# EAGLE design GROUP6_GPIO_Hat_v4.0_assignment (EAGLE 9.6.2)
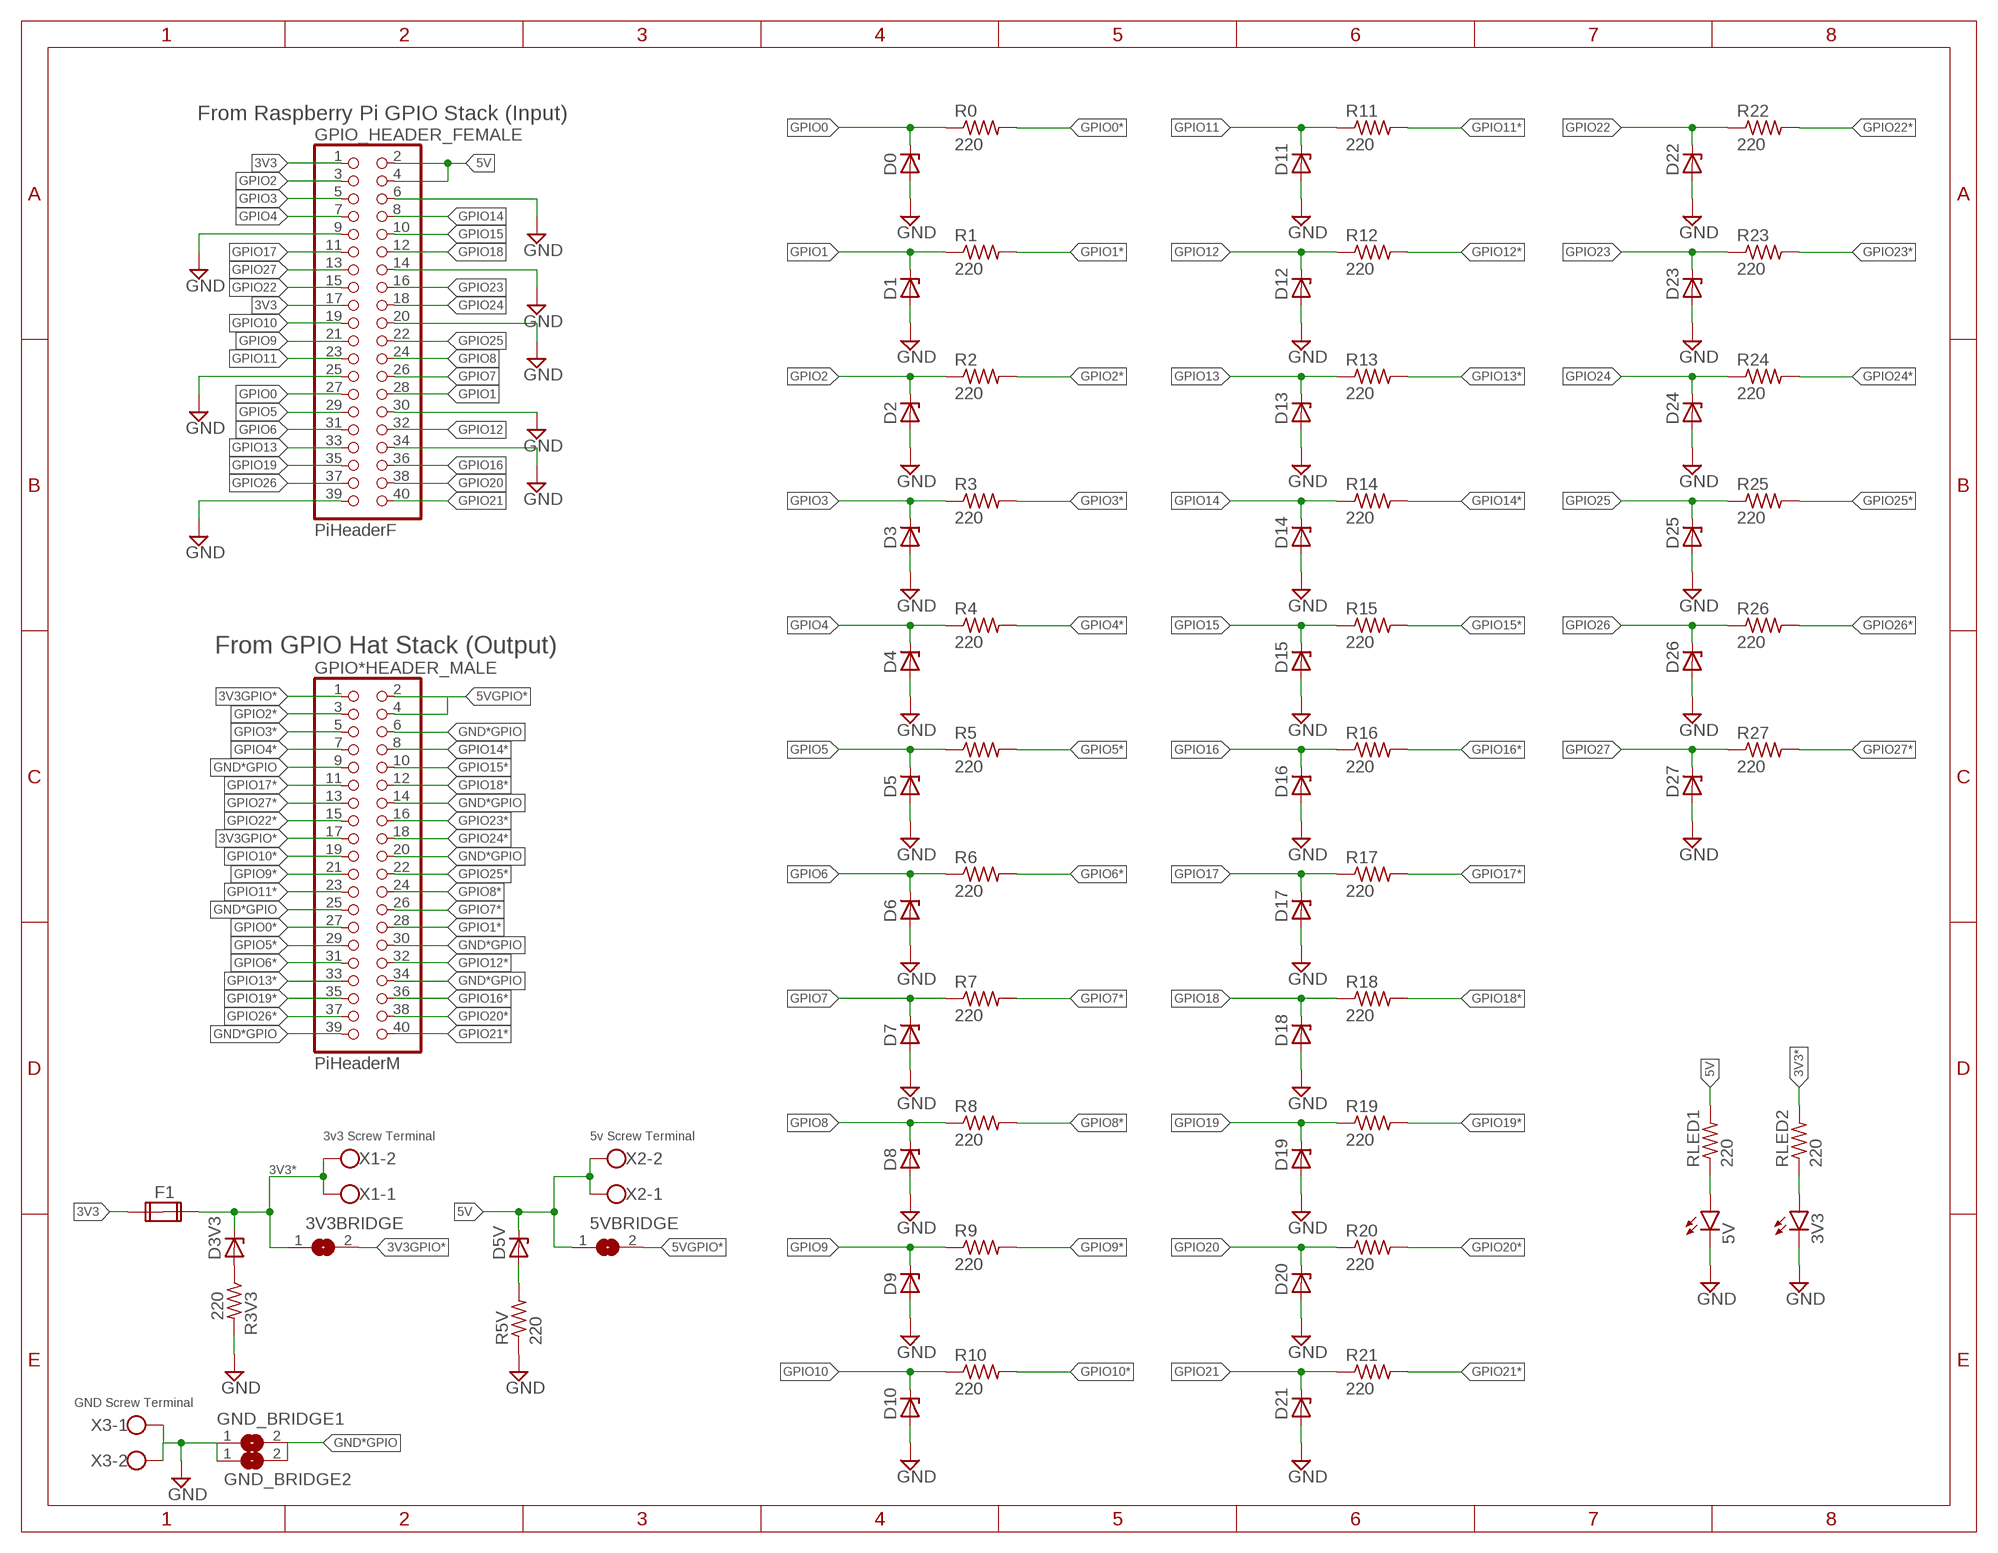
[diagram p0: schematic, sheet 1]

## Parts
3V3  LED5MM  [LED5MM]
3V3BRIDGE  SJ  [SJ]
5V  LED5MM  [LED5MM]
5VBRIDGE  SJ  [SJ]
D0  1N4728  [DO41Z10]
D1  1N4728  [DO41Z10]
D2  1N4728  [DO41Z10]
D3  1N4728  [DO41Z10]
D3V3  1N4728  [DO41Z10]
D4  1N4728  [DO41Z10]
D5  1N4728  [DO41Z10]
D5V  1N4728  [DO41Z10]
D6  1N4728  [DO41Z10]
D7  1N4728  [DO41Z10]
D8  1N4728  [DO41Z10]
D9  1N4728  [DO41Z10]
D10  1N4728  [DO41Z10]
D11  1N4728  [DO41Z10]
D12  1N4728  [DO41Z10]
D13  1N4728  [DO41Z10]
D14  1N4728  [DO41Z10]
D15  1N4728  [DO41Z10]
D16  1N4728  [DO41Z10]
D17  1N4728  [DO41Z10]
D18  1N4728  [DO41Z10]
D19  1N4728  [DO41Z10]
D20  1N4728  [DO41Z10]
D21  1N4728  [DO41Z10]
D22  1N4728  [DO41Z10]
D23  1N4728  [DO41Z10]
D24  1N4728  [DO41Z10]
D25  1N4728  [DO41Z10]
D26  1N4728  [DO41Z10]
D27  1N4728  [DO41Z10]
F1  FUSE2P  [FUSE1]
GND_BRIDGE1  SJ  [SJ]
GND_BRIDGE2  SJ  [SJ]
GPIO*HEADER_MALE  PiHeaderM  PINHD-2X20  [2X20]
GPIO_HEADER_FEMALE  PiHeaderF  PINHD-2X20  [2X20]
R0  220  R-US_0207/10  [0207/10]
R1  220  R-US_0207/10  [0207/10]
R2  220  R-US_0207/10  [0207/10]
R3  220  R-US_0207/10  [0207/10]
R3V3  220  R-US_0207/10  [0207/10]
R4  220  R-US_0207/10  [0207/10]
R5  220  R-US_0207/10  [0207/10]
R5V  220  R-US_0207/10  [0207/10]
R6  220  R-US_0207/10  [0207/10]
R7  220  R-US_0207/10  [0207/10]
R8  220  R-US_0207/10  [0207/10]
R9  220  R-US_0207/10  [0207/10]
R10  220  R-US_0207/10  [0207/10]
R11  220  R-US_0207/10  [0207/10]
R12  220  R-US_0207/10  [0207/10]
R13  220  R-US_0207/10  [0207/10]
R14  220  R-US_0207/10  [0207/10]
R15  220  R-US_0207/10  [0207/10]
R16  220  R-US_0207/10  [0207/10]
R17  220  R-US_0207/10  [0207/10]
R18  220  R-US_0207/10  [0207/10]
R19  220  R-US_0207/10  [0207/10]
R20  220  R-US_0207/10  [0207/10]
R21  220  R-US_0207/10  [0207/10]
R22  220  R-US_0207/10  [0207/10]
R23  220  R-US_0207/10  [0207/10]
R24  220  R-US_0207/10  [0207/10]
R25  220  R-US_0207/10  [0207/10]
R26  220  R-US_0207/10  [0207/10]
R27  220  R-US_0207/10  [0207/10]
RLED1  220  R-US_0207/10  [0207/10]
RLED2  220  R-US_0207/10  [0207/10]
X1  W237-102  [W237-102]
X2  W237-102  [W237-102]
X3  W237-102  [W237-102]

## Nets
3V3: F1.1A GPIO_HEADER_FEMALE.1 GPIO_HEADER_FEMALE.17
3V3*: 3V3BRIDGE.1 D3V3.C F1.2A RLED2.2 X1.1 X1.2
3V3GPIO*: 3V3BRIDGE.2 GPIO*HEADER_MALE.1 GPIO*HEADER_MALE.17
5V: 5VBRIDGE.1 D5V.C GPIO_HEADER_FEMALE.2 GPIO_HEADER_FEMALE.4 RLED1.2 X2.1 X2.2
5VGPIO*: 5VBRIDGE.2 GPIO*HEADER_MALE.2 GPIO*HEADER_MALE.4
GND: 3V3.K(C) 5V.K(C) D0.A D1.A D2.A D3.A D4.A D5.A D6.A D7.A D8.A D9.A D10.A D11.A D12.A D13.A D14.A D15.A D16.A D17.A D18.A D19.A D20.A D21.A D22.A D23.A D24.A D25.A D26.A D27.A GND_BRIDGE1.1 GND_BRIDGE2.1 GPIO_HEADER_FEMALE.6 GPIO_HEADER_FEMALE.9 GPIO_HEADER_FEMALE.14 GPIO_HEADER_FEMALE.20 GPIO_HEADER_FEMALE.25 GPIO_HEADER_FEMALE.30 GPIO_HEADER_FEMALE.34 GPIO_HEADER_FEMALE.39 R3V3.2 R5V.1 X3.1 X3.2
GND*GPIO: GND_BRIDGE1.2 GND_BRIDGE2.2 GPIO*HEADER_MALE.6 GPIO*HEADER_MALE.9 GPIO*HEADER_MALE.14 GPIO*HEADER_MALE.20 GPIO*HEADER_MALE.25 GPIO*HEADER_MALE.30 GPIO*HEADER_MALE.34 GPIO*HEADER_MALE.39
GPIO0: D0.C GPIO_HEADER_FEMALE.27 R0.1
GPIO0*: GPIO*HEADER_MALE.27 R0.2
GPIO1: D1.C GPIO_HEADER_FEMALE.28 R1.1
GPIO1*: GPIO*HEADER_MALE.28 R1.2
GPIO2: D2.C GPIO_HEADER_FEMALE.3 R2.1
GPIO2*: GPIO*HEADER_MALE.3 R2.2
GPIO3: D3.C GPIO_HEADER_FEMALE.5 R3.1
GPIO3*: GPIO*HEADER_MALE.5 R3.2
GPIO4: D4.C GPIO_HEADER_FEMALE.7 R4.1
GPIO4*: GPIO*HEADER_MALE.7 R4.2
GPIO5: D5.C GPIO_HEADER_FEMALE.29 R5.1
GPIO5*: GPIO*HEADER_MALE.29 R5.2
GPIO6: D6.C GPIO_HEADER_FEMALE.31 R6.1
GPIO6*: GPIO*HEADER_MALE.31 R6.2
GPIO7: D7.C GPIO_HEADER_FEMALE.26 R7.1
GPIO7*: GPIO*HEADER_MALE.26 R7.2
GPIO8: D8.C GPIO_HEADER_FEMALE.24 R8.1
GPIO8*: GPIO*HEADER_MALE.24 R8.2
GPIO9: D9.C GPIO_HEADER_FEMALE.21 R9.1
GPIO9*: GPIO*HEADER_MALE.21 R9.2
GPIO10: D10.C GPIO_HEADER_FEMALE.19 R10.1
GPIO10*: GPIO*HEADER_MALE.19 R10.2
GPIO11: D11.C GPIO_HEADER_FEMALE.23 R11.1
GPIO11*: GPIO*HEADER_MALE.23 R11.2
GPIO12: D12.C GPIO_HEADER_FEMALE.32 R12.1
GPIO12*: GPIO*HEADER_MALE.32 R12.2
GPIO13: D13.C GPIO_HEADER_FEMALE.33 R13.1
GPIO13*: GPIO*HEADER_MALE.33 R13.2
GPIO14: D14.C GPIO_HEADER_FEMALE.8 R14.1
GPIO14*: GPIO*HEADER_MALE.8 R14.2
GPIO15: D15.C GPIO_HEADER_FEMALE.10 R15.1
GPIO15*: GPIO*HEADER_MALE.10 R15.2
GPIO16: D16.C GPIO_HEADER_FEMALE.36 R16.1
GPIO16*: GPIO*HEADER_MALE.36 R16.2
GPIO17: D17.C GPIO_HEADER_FEMALE.11 R17.1
GPIO17*: GPIO*HEADER_MALE.11 R17.2
GPIO18: D18.C GPIO_HEADER_FEMALE.12 R18.1
GPIO18*: GPIO*HEADER_MALE.12 R18.2
GPIO19: D19.C GPIO_HEADER_FEMALE.35 R19.1
GPIO19*: GPIO*HEADER_MALE.35 R19.2
GPIO20: D20.C GPIO_HEADER_FEMALE.38 R20.1
GPIO20*: GPIO*HEADER_MALE.38 R20.2
GPIO21: D21.C GPIO_HEADER_FEMALE.40 R21.1
GPIO21*: GPIO*HEADER_MALE.40 R21.2
GPIO22: D22.C GPIO_HEADER_FEMALE.15 R22.1
GPIO22*: GPIO*HEADER_MALE.15 R22.2
GPIO23: D23.C GPIO_HEADER_FEMALE.16 R23.1
GPIO23*: GPIO*HEADER_MALE.16 R23.2
GPIO24: D24.C GPIO_HEADER_FEMALE.18 R24.1
GPIO24*: GPIO*HEADER_MALE.18 R24.2
GPIO25: D25.C GPIO_HEADER_FEMALE.22 R25.1
GPIO25*: GPIO*HEADER_MALE.22 R25.2
GPIO26: D26.C GPIO_HEADER_FEMALE.37 R26.1
GPIO26*: GPIO*HEADER_MALE.37 R26.2
GPIO27: D27.C GPIO_HEADER_FEMALE.13 R27.1
GPIO27*: GPIO*HEADER_MALE.13 R27.2
N$5: 5V.A RLED1.1
N$6: D3V3.A R3V3.1
N$7: D5V.A R5V.2
N$8: 3V3.A RLED2.1
Unconnected: F1.1B F1.2B

## Notes on the sheet
- From Raspberry Pi GPIO Stack (Input)
- From GPIO Hat Stack (Output)
- 3v3 Screw Terminal | 5v Screw Terminal
- GND Screw Terminal

## Library data of the parts
3V3 5V = led:LED: LED OSRAM: - CHIPLED LG R971, LG N971, LY N971, LG Q971, LY Q971, LO R971, LY R971 LH N974, LH R974 LS Q976, LO Q976, LY Q976 LO Q996 - Hyper CHIPLED LW Q18S LB Q993, LB Q99A, LB R99A - SideLED LS A670, LO A670, LY A670, LG A670, LP A670 LB A673, LV A673, LT A673, LW A673 LH A674 LY A675 LS A676, LA A676, LO A676, LY A676, LW A676 LS A679, LY A679, LG A679 - Hyper Micro SIDELED® LS Y876, LA Y876, LO Y876, LY Y876 LT Y87S - SmartLED LW L88C, LW L88S LB L89C, LB L89S, LG L890 LS L89K, LO L89K, LY L89K LS L896, LA L896, LO L896, LY L896 - TOPLED LS T670, LO T670, LY T670, LG T670, LP T670 LSG T670, LSP T670, LSY T670, LOP T670, LYG T670 LG T671, LOG T671, LSG T671 LB T673, LV T673, LT T673, LW T673 LH T674 LS T676, LA T676, LO T676, LY T676, LB T676, LH T676, LSB T676, LW T676 LB T67C, LV T67C, LT T67C, LS T67K, LO T67K, LY T67K, LW E67C LS E67B, LA E67B, LO E67B, LY E67B, LB E67C, LV E67C, LT E67C LW T67C LS T679, LY T679, LG T679 LS T770, LO T770, LY T770, LG T770, LP T770 LB T773, LV T773, LT T773, LW T773 LH T774 LS E675, LA E675, LY E675, LS T675 LS T776, LA T776, LO T776, LY T776, LB T776 LHGB T686 LT T68C, LB T68C - Hyper Mini TOPLED® LB M676 - Mini TOPLED Santana® LG M470 LS M47K, LO M47K, LY M47K Source: http://www.osram.convergy.de LUXEON: - LUMILED® LXK2-PW12-R00, LXK2-PW12-S00, LXK2-PW14-U00, LXK2-PW14-V00 LXK2-PM12-R00, LXK2-PM12-S00, LXK2-PM14-U00 LXK2-PE12-Q00, LXK2-PE12-R00, LXK2-PE12-S00, LXK2-PE14-T00, LXK2-PE14-U00 LXK2-PB12-K00, LXK2-PB12-L00, LXK2-PB12-M00, LXK2-PB14-N00, LXK2-PB14-P00, LXK2-PB14-Q00 LXK2-PR12-L00, LXK2-PR12-M00, LXK2-PR14-Q00, LXK2-PR14-R00 LXK2-PD12-Q00, LXK2-PD12-R00, LXK2-PD12-S00 LXK2-PH12-R00, LXK2-PH12-S00 LXK2-PL12-P00, LXK2-PL12-Q00, LXK2-PL12-R00 Source: www.luxeon.com KINGBRIGHT: KA-3528ASYC Source: www.kingbright.com
3V3BRIDGE 5VBRIDGE GND_BRIDGE1 GND_BRIDGE2 = jumper:SJ: SMD solder JUMPER
D0 D1-D3 D3V3 D4 D5 D5V D6-D27 = Zener_1N4728:1N4728: Z DIODE 3.3 V, 1W, 5 percent Check availability <https://pricing.snapeda.com/parts/1N4728/ON%20Semiconductor/view-part?ref=eda>; AVAILABILITY: In Stock; DESCRIPTION: Zener Diode 3.3V 1.3W ±5% Through Hole DO-204AL (DO-41); MF: ON Semiconductor; MP: 1N4728; PACKAGE: DO-41 ON Semiconductor; PRICE: None; PURCHASE-URL: https://pricing.snapeda.com/search/part/1N4728/?ref=eda
F1 = special:FUSE2P: FUSE 5 x 20 mm
GPIO*HEADER_MALE GPIO_HEADER_FEMALE = adafruit:PINHD-2X20: PIN HEADER
R0 R1-R3 R3V3 R4 R5 R5V R6-R27 RLED1 RLED2 = rcl:R-US_: RESISTOR, American symbol; SPICEPREFIX: R
X1-X3 = con-wago-500:W237-102: WAGO SCREW CLAMP; MPN: 237-102; OC_FARNELL: unknown; OC_NEWARK: 70K9898

## Board
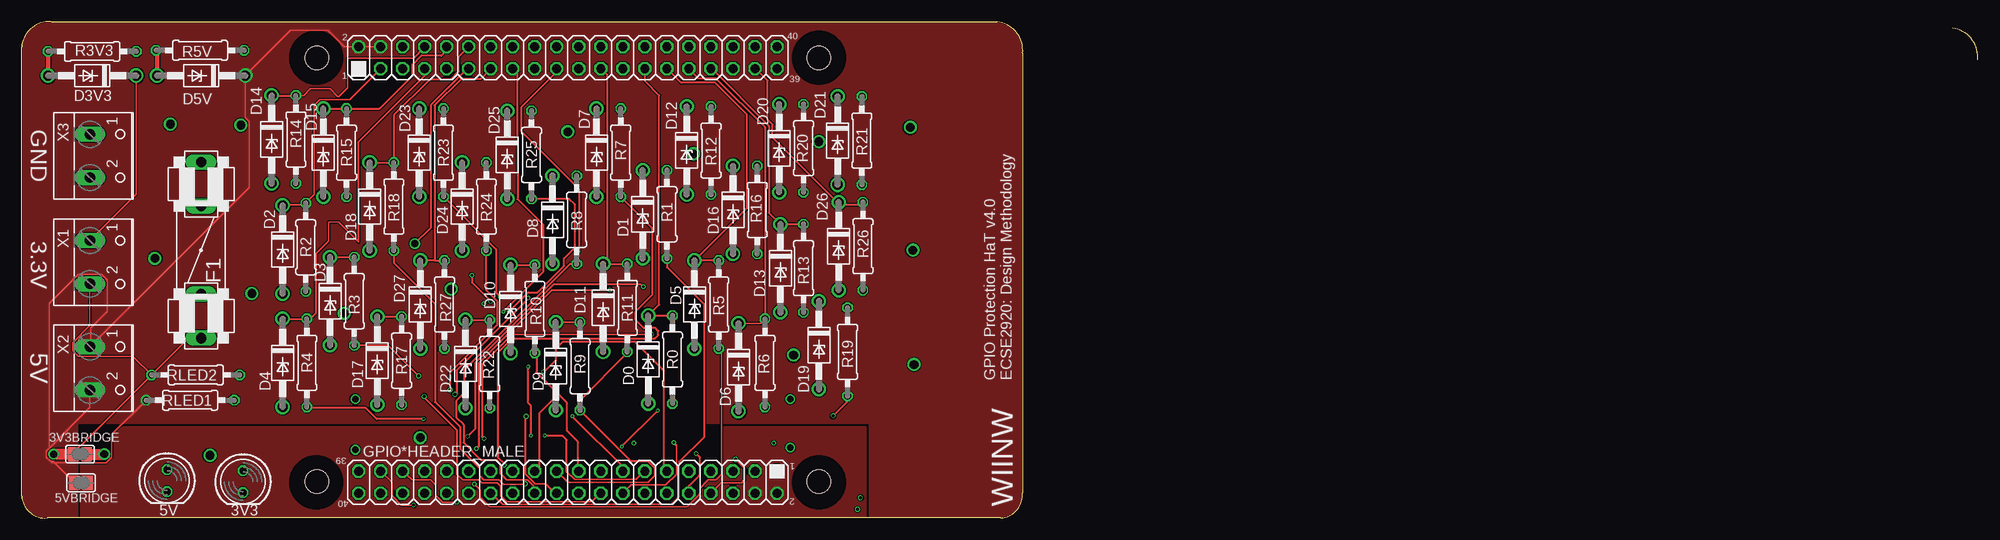
[diagram p1: board, top side]
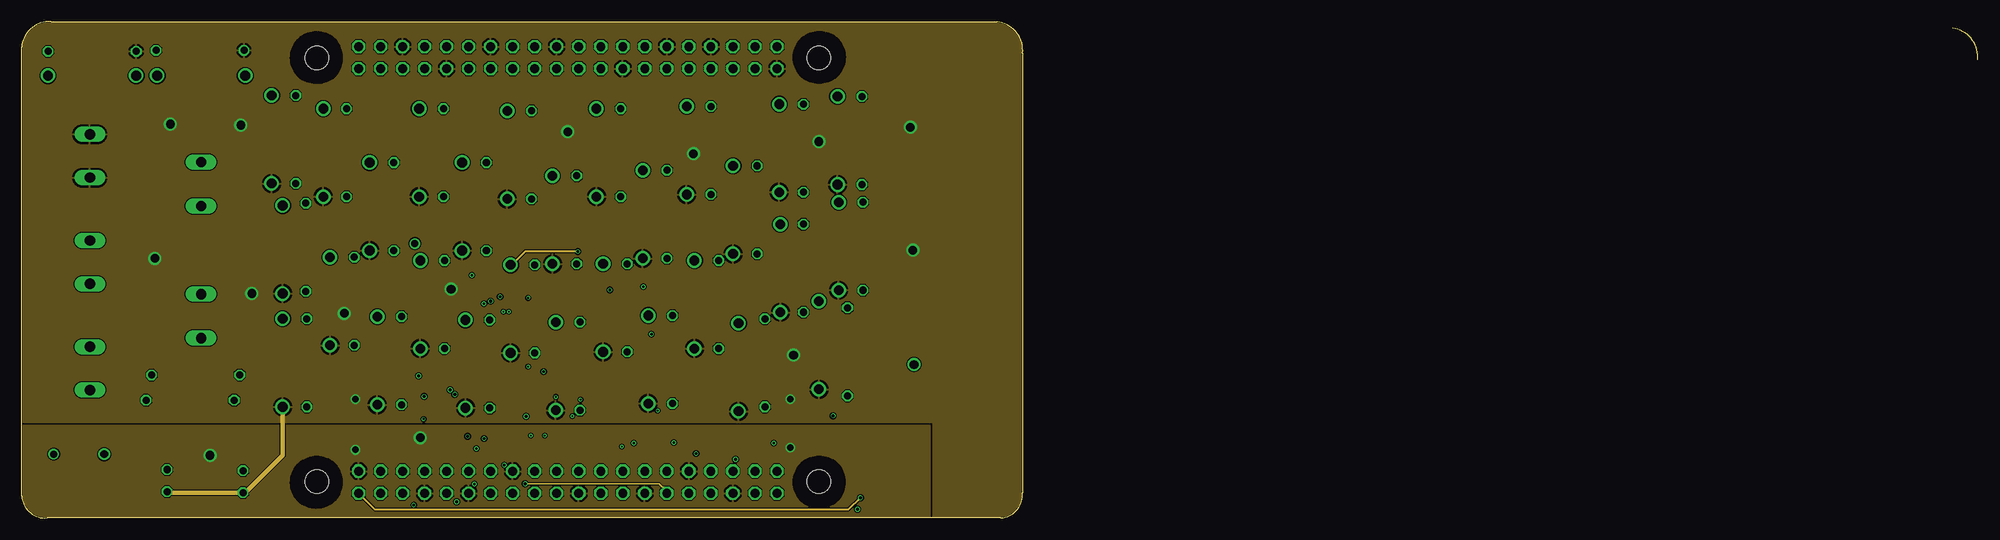
[diagram p2: board, inner layer Route2]
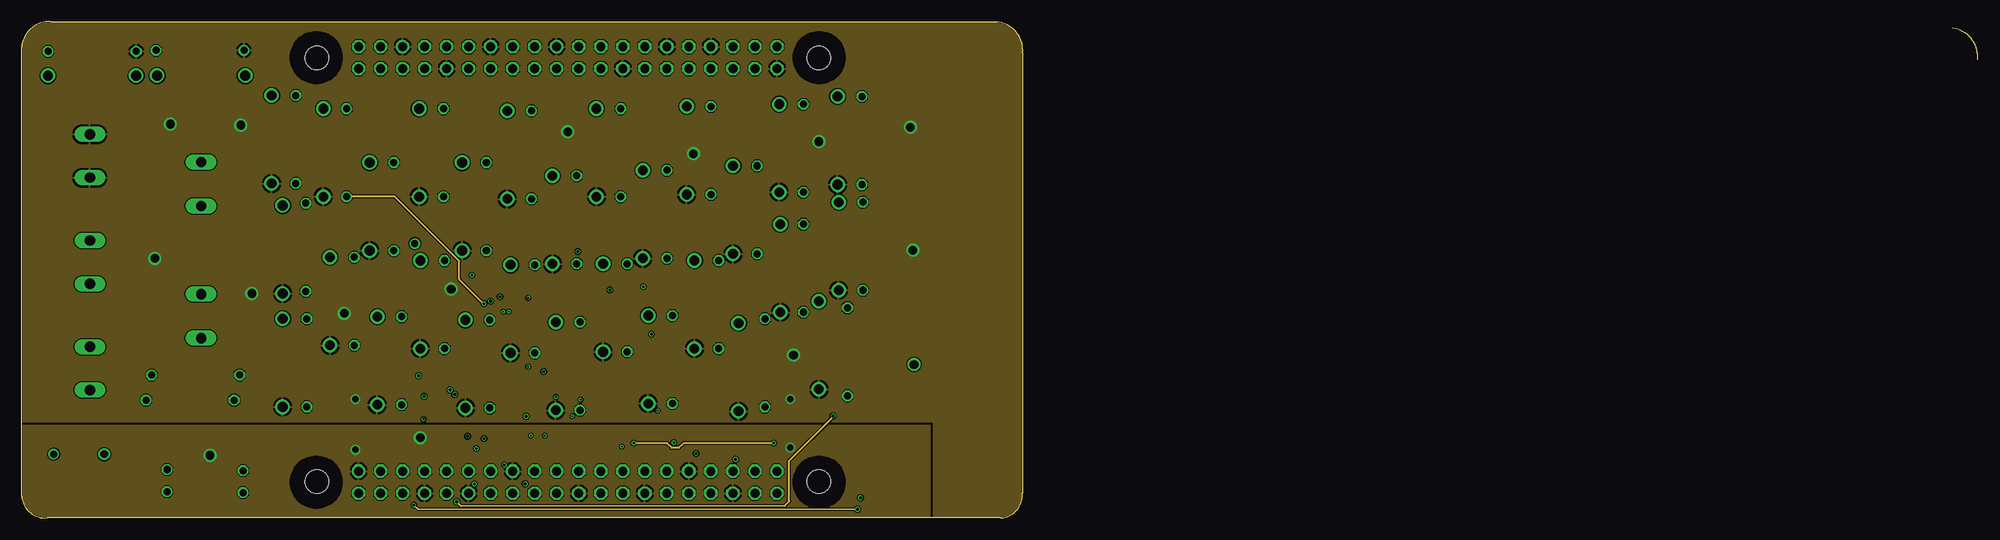
[diagram p3: board, inner layer Route15]
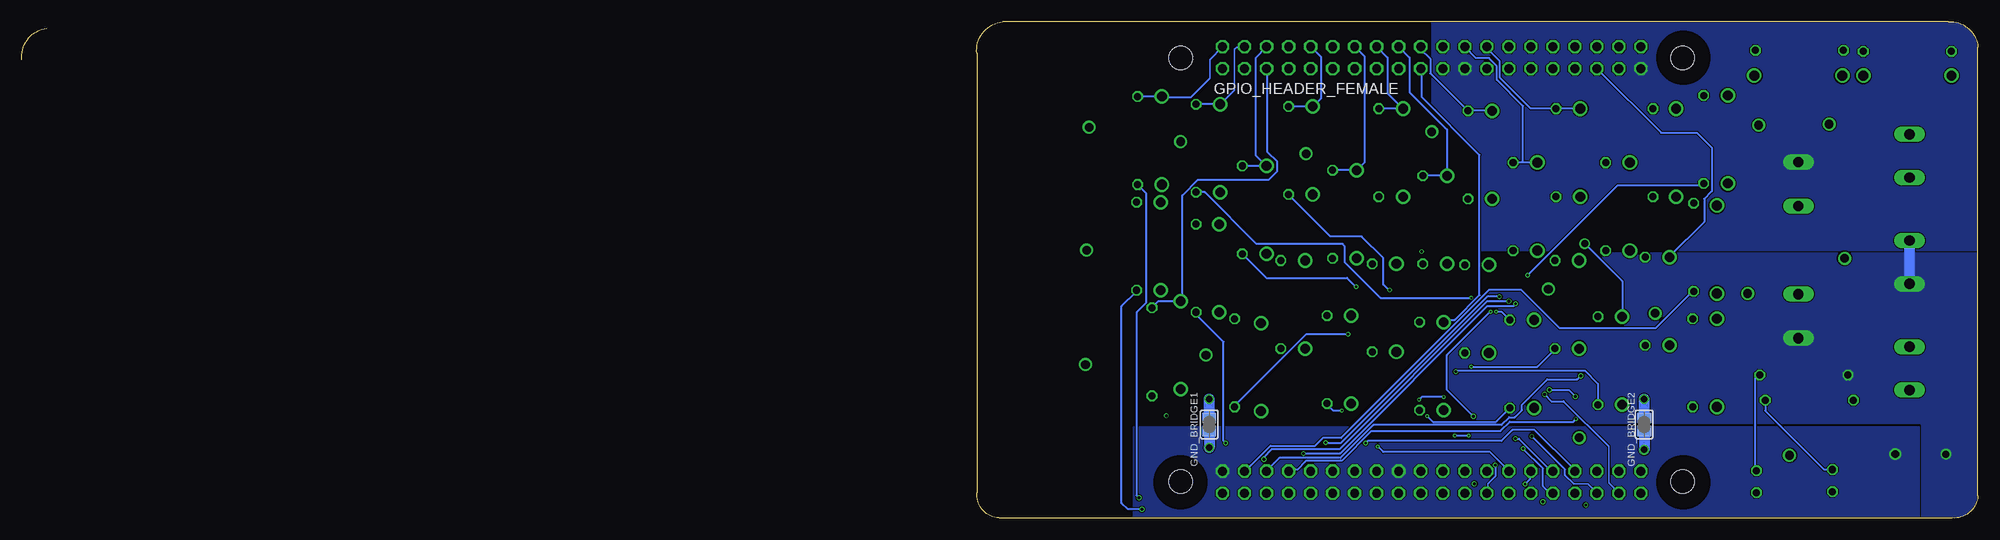
[diagram p4: board, bottom side, seen from below]

Size 225.61 x 57.29 mm. Coordinates in mm from the lower left corner, seen from the top.
Outline: 225.59,52.88 arc90 222.72,56.51
Outline: 0,2.55 0,54.32 arc-90 3.39,57.28 112.48,57.28 arc-90 115.44,53.64 115.44,2.93 arc-90 112.9,0.01 2.92,0.01 arc-90 0,2.55
Copper layers (1*2*15*16): Top 0.035559375mm / dielectric 0.17018125mm / Route2 0.01778125mm / dielectric 47mil / Route15 0.01778125mm / dielectric 0.17018125mm / Bottom 0.035559375mm
Design rules "jlcpcb-4-layer": minimum track width 5mil, minimum drill 0.2mm, track to track 0.126490625mm, track to pad 0.126490625mm, pad to pad 0.126490625mm, via to via 0.126490625mm, smd to smd 0mil, copper to edge 0.1mm, drill to drill 5mil, minimum pad ring 4mil, minimum via ring 4mil, stop-mask expansion 3mil, vias tented up to drill 100mil, thermal gap 10mil
Holes 2.7 mm at 34.04,53.09 34.04,4.2 91.95,4.2 91.95,53.09
tRestrict: area 31,50.1 to 37,56.1; area 89,50.1 to 95,56.1; area 89,1.1 to 95,7.1; area 31,1.1 to 37,7.1
bRestrict: area 31,1.1 to 37,7.1; area 31,50.1 to 37,56.1; area 89,50.1 to 95,56.1; area 89,1.1 to 95,7.1

### Footprints (pad centres in the part's own frame; a part is rotated, then mirrored left to right if it is on the bottom)
LED5MM = drill 0.813 octagon: A -1.27,0; K 1.27,0
SJ = smd 1.168 x 1.6: 1 -0.762,0; 2 0.762,0
DO41Z10 = drill 1.118: A 5.08,0; C -5.08,0
FUSE1 = drill 1.194 long: 1A -10.16,0; 1B -5.08,0; 2A 10.16,0; 2B 5.08,0
2X20 = drill 1.016 octagon: 1 -24.13,-1.27; 2 -24.13,1.27; 3 -21.59,-1.27; 4 -21.59,1.27; 5 -19.05,-1.27; 6 -19.05,1.27; 7 -16.51,-1.27; 8 -16.51,1.27; 9 -13.97,-1.27; 10 -13.97,1.27; 11 -11.43,-1.27; 12 -11.43,1.27; 13 -8.89,-1.27; 14 -8.89,1.27; 15 -6.35,-1.27; 16 -6.35,1.27; 17 -3.81,-1.27; 18 -3.81,1.27; 19 -1.27,-1.27; 20 -1.27,1.27; 21 1.27,-1.27; 22 1.27,1.27; 23 3.81,-1.27; 24 3.81,1.27; 25 6.35,-1.27; 26 6.35,1.27; 27 8.89,-1.27; 28 8.89,1.27; 29 11.43,-1.27; 30 11.43,1.27; 31 13.97,-1.27; 32 13.97,1.27; 33 16.51,-1.27; 34 16.51,1.27; 35 19.05,-1.27; 36 19.05,1.27; 37 21.59,-1.27; 38 21.59,1.27; 39 24.13,-1.27; 40 24.13,1.27
0207/10 = drill 0.813 octagon: 1 -5.08,0; 2 5.08,0
W237-102 = drill 1.194 long: 1 -2.5,-1.27; 2 2.5,-1.27

### Placement (x,y rotation side)
3V3  25.53,4.2 270 top
3V3BRIDGE  6.73,7.37 0 top
5V  16.76,4.32 270 top
5VBRIDGE  6.86,4.07 0 top
D0  72.26,18.29 270 top
D1  71.63,35.06 270 top
D2  30.1,30.99 270 top
D3  35.56,25.02 270 top
D3V3  8.13,51.06 180 top
D4  30.1,17.91 270 top
D5  77.6,24.64 270 top
D5V  20.7,51.06 180 top
D6  82.68,17.4 270 top
D7  66.29,42.17 270 top
D8  61.21,34.42 270 top
D9  61.59,17.53 270 top
D10  56.39,24.14 270 top
D11  67.06,24.26 270 top
D12  76.71,42.42 270 top
D13  87.5,28.83 270 top
D14  28.83,43.69 270 top
D15  34.8,42.17 270 top
D16  82.04,35.57 270 top
D17  41.02,18.17 270 top
D18  40.13,35.95 270 top
D19  91.95,19.94 270 top
D20  87.38,42.68 270 top
D21  94.11,43.57 270 top
D22  51.18,17.79 270 top
D23  45.85,42.17 270 top
D24  50.8,35.95 270 top
D25  56.01,41.92 270 top
D26  94.23,31.37 270 top
D27  45.97,24.64 270 top
F1  20.7,30.93 270 top
GND_BRIDGE1  88.65,10.8 270 bottom
GND_BRIDGE2  38.48,10.8 270 bottom
GPIO*HEADER_MALE  62.98,4.14 180 top
GPIO_HEADER_FEMALE  62.98,53.14 0 top
R0  75.06,18.29 270 top
R1  74.42,35.06 270 top
R2  32.77,31.25 270 top
R3  38.35,25.02 270 top
R3V3  8.13,53.85 0 top
R4  32.89,17.91 270 top
R5  80.39,24.64 270 top
R5V  20.57,53.98 180 top
R6  85.72,17.91 270 top
R7  69.09,42.17 270 top
R8  64.01,34.42 270 top
R9  64.39,17.53 270 top
R10  59.18,24.14 270 top
R11  69.85,24.26 270 top
R12  79.5,42.42 270 top
R13  90.17,28.83 270 top
R14  31.62,43.69 270 top
R15  37.47,42.17 270 top
R16  84.84,35.57 270 top
R17  43.81,18.17 270 top
R18  42.93,35.95 270 top
R19  95.25,19.18 270 top
R20  90.17,42.68 270 top
R21  96.9,43.57 270 top
R22  53.98,17.79 270 top
R23  48.64,42.17 270 top
R24  53.59,35.95 270 top
R25  58.8,41.92 270 top
R26  97.03,31.37 270 top
R27  48.77,24.64 270 top
RLED1  19.43,13.59 180 top
RLED2  20.07,16.52 180 top
X1  9.14,29.53 270 top
X2  9.14,17.28 270 top
X3  9.14,41.79 270 top

### Tracks (layer width: path | path; a pad name or v marks a point on that pad's centre or on a via)
3V3
  pour Bottom (no thermals): -3.3,58.68 -3.3,30.87 62.99,30.87 62.99,58.68
3V3*  (via drill 0.81)
  Top 0.152: D3V3.C 13.21,37.37 X1.1 | RLED2.2 12.82,18.68 6.52,18.68 5.88,19.32 5.88,20.23 7.87,22.23 X1.2 | RLED2.2 19.24,20.77 F1.2A | RLED2.2 6.84,8.37 6.82,8.37 5.97,7.52 3V3BRIDGE.1
  Top 1.27: 3V3BRIDGE.1 v3.68,7.37
  Bottom 1.27: X1.2 X1.1
  pour Bottom (no thermals): -3.18,30.58 -3.18,-0.88 6.45,-0.88 6.45,10.77 6.6,10.93 97.79,10.93 97.79,-0.88 117.86,-0.88 117.86,58.67 63.27,58.67 63.27,30.58
3V3GPIO*  (via drill 0.9)
  Top 1.27: 3V3BRIDGE.2 v9.53,7.37
  pour Bottom (no thermals): 97.41,-0.88 97.41,10.55 6.73,10.55 6.73,-0.88
5V
  Top 0.152: X2.1 7.96,19.86 | 7.96,19.86 26.23,38.13 26.23,45.74 25.78,46.18 D5V.C 31.04,56.32 35.3,56.32 37.2,54.41 GPIO_HEADER_FEMALE.2 GPIO_HEADER_FEMALE.4 | 3.34,6.53 3.5,6.37 9.76,6.37 10.4,7.01 10.4,9.65 RLED1.2 | X2.2 7.87,12.75 3.18,8.05 | 3.34,6.53 2.84,7.02 2.84,7.72 3.18,8.05 | 5VBRIDGE.1 3.63,6.53 3.34,6.53 | 7.96,19.86 7.96,21.91 9.87,23.82 9.87,27.49 9.22,28.13 6.52,28.13 3.18,24.78 3.18,8.05
  pour Top (no thermals): -2.54,58.17 -2.54,-0.63 6.48,-0.63 6.48,10.93 97.79,10.93 97.79,-0.25 116.97,-0.25 116.97,58.17
5VGPIO*
  pour Top (no thermals): 97.41,-0.5 6.8,-0.5 6.8,10.55 97.41,10.55
GND  (via drill 0.75, 1)
  Route2 0.508: 5V.K 16.89,3.05 17.02,2.93 3V3.K 25.78,2.93 30.1,7.24 D4.A
  Bottom 1.27: GND_BRIDGE2.1 v38.48,13.72 | GND_BRIDGE1.1 v88.65,13.72
  other vias: 17.14,45.47 25.27,45.34 15.37,29.98 26.54,25.91 37.21,23.63 49.53,26.42 77.47,42.04 62.99,44.58 91.95,43.44 89.03,18.8 102.49,45.09 102.78,30.92
  pour Route15: -3.92,59.4 -3.92,11.08 105.16,11.05 105.16,-1.77 118.87,-1.77 118.87,11.07 118.89,11.07 118.89,59.4
  pour Route2: -4.83,59.95 120.02,59.95 120.02,-2.28 105.16,-2.28 105.16,11.05 -4.83,11.05
  cutout Route2: 30.99,4.07 arc-90 34.04,7.12 arc-90 36.96,4.2 36.96,4.07 arc-90 34.04,1.15 33.91,1.15 arc-90
  cutout Route2: 30.99,53.09 arc-90 34.04,56.14 arc-90 36.96,53.22 36.96,52.96 arc-90 34.16,50.17 34.04,50.17 33.91,50.17 arc-90
  cutout Route2: 91.95,56.14 arc90 88.98,53.17 88.98,53.14 arc90 91.95,50.17 arc90 95,53.22 arc90 92.08,56.14
  cutout Route15: 33.98,7.14 arc-90 36.98,4.14 arc-90 33.98,1.14 arc-90 30.98,4.14 arc-90
  cutout Route15: 30.98,53.14 arc-90 33.98,56.14 arc-90 36.98,53.14 arc-90 33.98,50.14 arc-90
  cutout Route15: 88.98,53.14 arc-90 91.98,56.14 arc-90 94.98,53.14 arc-90 91.98,50.14 arc-90
  cutout Route15: 91.98,7.14 arc90 88.98,4.14 arc90 91.98,1.14 arc90 94.98,4.14 arc90
  cutout Route2: 91.98,7.14 arc90 88.98,4.14 arc90 91.98,1.14 arc90 94.98,4.14 arc90
GND1  (via drill 1)
  other vias: 102.91,17.71
GND*GPIO  (via drill 0.75, 1)
  Bottom 1.27: GND_BRIDGE2.2 v38.48,7.88 | GND_BRIDGE1.2 v88.65,8.13
  other vias: 45.97,9.28 21.72,7.24
  pour Route2: -4.95,10.67 104.78,10.67 104.78,-1.9 -4.95,-1.9
  pour Route15: -3.94,10.67 104.78,10.67 104.78,-1.39 -3.94,-1.39
GPIO0
  Top 0.203: R0.1 D0.C 73.53,24.64 73.53,48.77 71.88,50.42 GPIO_HEADER_FEMALE.27
GPIO0*  (via drill 0.2)
  Top 0.203: v69.22,8.26 v73.34,12.39
  Bottom 0.203: GPIO*HEADER_MALE.27 55.25,6.61 56.26,7.63 68.58,7.63 v69.22,8.26 | v73.34,12.39 74.3,12.39 74.93,13.02 R0.2
GPIO1
  Bottom 0.203: R1.1 D1.C 70.74,41.03 70.74,53.28 GPIO_HEADER_FEMALE.28
GPIO1*
  Top 0.152: 75.84,6.48 75.84,2.44 74.98,1.58 55.45,1.58 GPIO*HEADER_MALE.28
  Top 0.203: R1.2 74.42,28.96 78.74,24.64 78.74,9.38 75.84,6.48
GPIO2
  Top 0.152: R2.1 33.76,37.32 33.76,47.68 34.37,48.29 37.81,48.29 GPIO_HEADER_FEMALE.3
  Top 0.203: R2.1 32.7,36.2 30.16,36.2 D2.C
GPIO2*
  Bottom 0.203: GPIO*HEADER_MALE.3 84.45,5.47 81.56,8.36 76.43,8.36 75.54,9.25 73.43,9.25 56.33,26.36 52.7,26.36 48.26,21.91 37.15,21.91 33.02,26.04 R2.2
GPIO3
  Top 0.203: D3.C R3.1
  Bottom 0.203: D3.C 35.56,30.17 31.56,34.17 31.56,36.84 30.67,37.72 30.67,42.74 32.38,44.46 36.51,44.46 43.81,51.76 GPIO_HEADER_FEMALE.5
GPIO3*  (via drill 0.35)
  Top 0.203: v45.8,16.41 42.27,19.94 R3.2
  Bottom 0.203: GPIO*HEADER_MALE.5 81.92,5.59 80.57,6.94 73.5,6.94 69.7,10.74 54.93,10.74 54.04,11.63 53.4,11.63 52.58,12.45 52.58,13.09 49.66,16.01 46.2,16.01 v45.8,16.41
GPIO4
  Top 0.152: 35.31,31.88 35.43,32.01 35.43,34.17 36.58,34.17 38.86,31.88
  Top 0.203: D4.C R4.1 33.27,22.99 33.91,23.63 33.91,30.49 35.31,31.88 | GPIO_HEADER_FEMALE.7 46.48,51.06 38.86,43.44 38.86,31.88
GPIO4*  (via drill 0.2)
  Top 0.203: v46.36,11.44 40.96,11.44 39.69,12.71 33.02,12.71 R4.2
  Bottom 0.203: GPIO*HEADER_MALE.7 79.38,5.59 78.49,5.59 77.47,6.61 73.36,6.61 69.93,10.04 55.05,10.04 53.98,11.12 46.67,11.12 v46.36,11.44
GPIO5
  Top 0.203: R5.1 D5.C 83.58,35.7 83.58,46.62 80,50.22 76.06,50.22 GPIO_HEADER_FEMALE.29
GPIO5*  (via drill 0.3)
  Top 0.152: v52.22,3.92 52.88,3.26 52.88,2.4 54,1.28 76.74,1.28 78.23,2.77 78.23,3.43 79.19,4.39 80.07,4.39 80.75,5.06 80.75,19.33
  Top 0.203: R5.2 80.52,19.56 80.75,19.33
  Bottom 0.203: v52.22,3.92 51.69,4.45 51.69,5.34 GPIO*HEADER_MALE.29
GPIO6
  Top 0.152: R6.1 85.22,22.48 D6.C
  Top 0.203: GPIO_HEADER_FEMALE.31 78.09,50.73 80.09,50.73 85.72,45.09 R6.1
GPIO6*  (via drill 0.3)
  Top 0.152: v72.64,21.21 56.56,21.21 56.54,21.19
  Top 0.203: 56.54,21.19 53.09,17.74 53.09,9.4 v53.34,9.15
  Bottom 0.203: R6.2 85.72,12.96 77.47,21.21 v72.64,21.21 | v53.34,9.15 52.91,9.15 49.17,5.41 GPIO*HEADER_MALE.31
GPIO7
  Bottom 0.203: R7.1 D7.C 68.07,49.03 68.07,53.15 GPIO_HEADER_FEMALE.26
GPIO7*  (via drill 0.3)
  Top 0.203: v55.65,6.13 55.65,6.29 54.97,6.97 54.97,19.14 56.56,20.73 73.05,20.73 73.41,21.09 73.41,21.6 73.09,21.91 71.75,21.91 70.8,22.87 70.8,23.82 72.71,25.72 72.71,33.47 R7.2
  Bottom 0.152: 55.64,4.82 56.52,3.94 56.52,3.05 GPIO*HEADER_MALE.26
  Bottom 0.203: 55.64,4.82 55.64,6.12 v55.65,6.13
GPIO8
  Bottom 0.203: R8.1 D8.C 61.21,44.84 65.53,49.15 65.53,53.15 GPIO_HEADER_FEMALE.24
GPIO8*
  Top 0.152: 59.03,3.08 59.03,3.73 58.34,4.42 55.95,4.42 55.19,5.18 55.19,6.28 54.76,6.71
  Top 0.203: R8.2 63.27,29.34 51.05,17.13 51.05,14.47 50.12,13.53 50.12,11.63 50.95,10.79 50.95,8.72 52.96,6.71 53.66,6.71 54.76,6.71 | GPIO*HEADER_MALE.24 59.03,3.08
GPIO9
  Top 0.203: D9.C R9.1
  Bottom 0.203: GPIO_HEADER_FEMALE.21 64.14,51.76 64.14,48.58 57.47,41.92 57.47,25.72 60.33,22.87 61.59,22.87 D9.C
GPIO9*
  Top 0.152: 73.04,4.95 72.23,4.14 63.05,4.14 GPIO*HEADER_MALE.21
  Top 0.203: R9.2 70.31,6.53 72.26,6.53 73.04,5.76 73.04,4.95
GPIO10  (via drill 0.3)
  Top 0.203: D10.C R10.1 | GPIO_HEADER_FEMALE.19 61.71,51.53 57.63,47.45 57.63,44.61 64.29,37.95 64.29,30.92 v64.14,30.76
  Route2 0.203: v64.14,30.76 58.06,30.76 56.52,29.22 D10.C
GPIO10*
  Top 0.203: GPIO*HEADER_MALE.19 64.14,5.72 64.14,8.83 62.86,10.1 62.86,13.34 59.37,16.83 59.37,19.06 R10.2
GPIO11
  Top 0.203: R11.1 D11.C 67.59,29.88 67.55,51.11 GPIO_HEADER_FEMALE.23
GPIO11*  (via drill 0.2)
  Top 0.152: 59.69,5.93 GPIO*HEADER_MALE.23
  Top 0.203: v64.45,13.66 69.85,19.06 R11.2 | v61.59,13.98 59.69,12.07 59.69,5.93
  Bottom 0.203: v64.45,13.66 64.14,13.98 v61.59,13.98
GPIO12
  Bottom 0.203: R12.1 D12.C 75.79,48.42 75.79,53.25 GPIO_HEADER_FEMALE.32
GPIO12*  (via drill 0.3)
  Top 0.203: v67.84,26.32 61.2,26.32 52.7,17.83 52.7,8.26 v52.45,8.01
  Bottom 0.152: GPIO*HEADER_MALE.32 49.35,2.87 50.16,3.69
  Bottom 0.203: R12.2 74.68,32.52 71.07,32.52 68.58,30.03 68.58,26.95 67.95,26.32 v67.84,26.32 | v52.45,8.01 50.16,5.72 50.16,3.69
GPIO13
  Top 0.203: R13.1 D13.C 86.19,35.22 86.19,45.21 79.6,51.87 GPIO_HEADER_FEMALE.33
GPIO13*  (via drill 0.3)
  Route15 0.203: v86.74,8.64 76.35,8.64 75.79,8.08 75.01,8.08 74.45,8.64 v70.61,8.64
  Bottom 0.203: v70.61,8.64 70.36,8.9 54.93,8.9 53.66,10.17 51.12,10.17 46.67,5.72 GPIO*HEADER_MALE.33 | v86.74,8.64 87,8.9 87,20.33 90.17,23.5 R13.2
GPIO14
  Top 0.152: 45.21,53.09 37.59,53.09 37.59,49.66 36.58,48.65 36.45,48.65 35.56,49.54 33.27,49.54 32.51,48.77 R14.1
  Top 0.203: D14.C R14.1 | 45.21,53.09 GPIO_HEADER_FEMALE.8
GPIO14*  (via drill 0.3, 0.35)
  Top 0.152: GPIO*HEADER_MALE.8 80.67,4.09 83.06,4.09
  Top 0.203: v82.35,6.76 83.36,5.75 83.36,4.4 83.06,4.09 | v54.1,25.02 51.94,27.18 51.94,27.99 v51.93,28.01
  Bottom 0.152: v82.35,6.76 82.35,7.02
  Bottom 0.203: 82.35,7.02 81.39,7.97 73.6,7.97 56.54,25.02 v54.1,25.02 | v51.93,28.01 51.93,28.02 41.53,38.42 31.75,38.42 R14.2
GPIO15
  Top 0.203: D15.C R15.1 41.27,47.25 45.09,51.06 45.09,52.33 46.1,53.35 48.39,53.35 49.02,53.98 GPIO_HEADER_FEMALE.10
GPIO15*  (via drill 0.3)
  Top 0.203: v77.78,7.45 78.18,7.04 78.18,4.96 76.96,3.74 GPIO*HEADER_MALE.10
  Route15 0.203: v53.29,24.72 50.47,27.54 50.47,29.66 43.04,37.09 R15.2
  Bottom 0.203: v77.78,7.45 77.73,7.5 73.53,7.5 56.57,24.47 53.54,24.47 v53.29,24.72
GPIO16
  Bottom 0.203: R16.1 D16.C 83.31,41.92 83.31,53.09 GPIO_HEADER_FEMALE.36
GPIO16*  (via drill 0.3)
  Top 0.203: v71.7,26.68 71.45,26.93 61.34,26.93 52.32,17.92 52.32,10.32 v51.44,9.43
  Bottom 0.152: 47.62,4.96 46.61,3.94 44.96,3.94 GPIO*HEADER_MALE.36
  Bottom 0.203: R16.2 82.07,27.72 72.75,27.72 v71.7,26.68 | v51.44,9.43 47.62,5.62 47.62,4.96
GPIO17  (via drill 0.81)
  Top 0.203: D17.C R17.1 | GPIO_HEADER_FEMALE.11 51.4,51.87 47.17,47.64 47.17,33.5 v45.34,31.67
  Bottom 0.203: v45.34,31.67 41.02,27.35 D17.C
GPIO17*  (via drill 0.3)
  Top 0.203: v60.2,16.9 60.33,16.9 61.59,18.17 61.59,19.51 62.41,20.33 70.76,20.33 74.04,17.05 74.03,5.79 GPIO*HEADER_MALE.11
  Bottom 0.203: R17.2 43.81,15.5 45.34,17.02 60.07,17.02 v60.2,16.9
GPIO18
  Top 0.203: D18.C R18.1 42.93,46.49 47.12,50.68 49.53,50.68 50.41,51.56 50.41,53.23 GPIO_HEADER_FEMALE.12
GPIO18*  (via drill 0.35)
  Top 0.152: 52.81,5.75 52.81,4.86 53.26,4.4 55.04,4.4 55.55,3.89 58.04,3.89 v58.09,3.94
  Top 0.203: 52.81,5.75 50.57,7.98 50.57,10.5 47.68,13.39 47.68,24.73 42.93,29.48 R18.2
  Route2 0.152: v58.09,3.94 73.53,3.94 74.3,3.18
  Route2 0.203: 74.3,3.18 74.3,3.05 GPIO*HEADER_MALE.12
GPIO19
  Bottom 0.203: R19.1 94.49,25.02 D19.C 91.76,25.09 91.76,37.24 89.94,39.06 81.79,39.06 80.8,40.04 80.8,41.12 81.92,42.23 81.92,51.76 GPIO_HEADER_FEMALE.35
GPIO19*  (via drill 0.35)
  Top 0.152: 50.1,1.82 48.55,1.82 47.73,2.65 47.73,3.84 47.17,4.4 45.01,4.4 GPIO*HEADER_MALE.35
  Top 0.203: v50.16,1.89 50.1,1.82 | R19.2 95.25,13.47 v93.6,11.82
  Route15 0.152: 88.01,1.4 50.65,1.4
  Route15 0.203: v50.16,1.89 50.65,1.4 | 88.01,1.4 88.52,1.91 88.52,6.61 93.6,11.69 v93.6,11.82
GPIO20
  Bottom 0.152: GPIO_HEADER_FEMALE.38 85.47,54.36 85.74,54.09 85.74,49.39 D20.C
  Bottom 0.203: D20.C R20.1
GPIO20*  (via drill 0.2, 0.35)
  Top 0.203: v58.42,25.41 58.42,25.28 50.16,17.02 50.16,14.29 v49.96,14.25
  Bottom 0.152: GPIO*HEADER_MALE.38 42.57,4.05 42.57,8.29
  Bottom 0.203: R20.2 89.15,37.6 83.19,31.63 73.28,31.63 73.03,31.37 73.03,29.53 68.9,25.41 v58.42,25.41 | 42.57,8.29 47.78,13.49 49.2,13.49 v49.96,14.25
GPIO21
  Bottom 0.152: GPIO_HEADER_FEMALE.40 88.58,52.92 88.58,50.75
  Bottom 0.203: R21.1 D21.C 93.99,48.53 90.79,48.53 88.58,50.75
GPIO21*  (via drill 0.35)
  Route2 0.203: GPIO*HEADER_MALE.40 40.7,1.02 95.39,1.02 v96.72,2.35
  Bottom 0.203: R21.2 95.89,37.47 95.89,24.9 97.03,23.75 97.03,2.66 v96.72,2.35
GPIO22  (via drill 0.2)
  Top 0.203: D22.C R22.1 | GPIO_HEADER_FEMALE.15 57.16,51.34 57.17,36.81 60.13,33.85 60.13,28.39 v55.56,23.82
  Bottom 0.203: R22.1 54.93,23.82 v55.56,23.82
GPIO22*  (via drill 0.2)
  Top 0.203: v63.5,11.75 69.53,5.72 GPIO*HEADER_MALE.15
  Bottom 0.203: R22.2 55.56,11.12 62.86,11.12 v63.5,11.75
GPIO23
  Bottom 0.203: D23.C R23.1 51.56,47.25 55.14,50.83 55.14,52.74 56.64,54.24 GPIO_HEADER_FEMALE.16
GPIO23*  (via drill 0.3)
  Top 0.152: 75.51,8.39 75.51,5.08 74.29,3.85 70.27,3.85 GPIO*HEADER_MALE.16
  Top 0.203: v75.21,8.69 75.51,8.39 | v55.18,25.55 54.74,25.99 54.74,30.99 R23.2
  Bottom 0.203: v75.21,8.69 73.43,8.69 56.58,25.55 v55.18,25.55
GPIO24
  Bottom 0.203: D24.C 52.45,41.03 | 52.45,41.03 R24.1 | GPIO_HEADER_FEMALE.18 57.9,53.09 56.39,53.09 55.47,52.18 55.47,50.57 52.45,47.55 52.45,41.03
GPIO24*  (via drill 0.35)
  Top 0.152: GPIO*HEADER_MALE.18 65.73,1.86 55.93,1.86 55.25,2.55 55.25,3.69 54.86,4.07 53.07,4.07 52.73,4.41 50.84,4.41 50.19,5.06
  Top 0.203: R24.2 53.59,26.29 54.86,25.02 54.86,22.26 49.43,16.83 v49.43,14.79 | v46.41,14.02 46.41,13.95 50.19,10.17 50.19,5.06
  Bottom 0.203: v49.43,14.79 47.17,14.79 v46.41,14.02
GPIO25
  Bottom 0.203: D25.C R25.1 63.14,51.34 63.14,53.02 64.26,54.13 GPIO_HEADER_FEMALE.22
GPIO25*  (via drill 0.2, 0.35)
  Top 0.152: 58.06,5.1 59.22,3.94 60.45,3.94 61.47,2.93 GPIO*HEADER_MALE.22
  Top 0.203: R25.2 63.14,36.84 63.75,36.23 63.75,31.18 62.55,29.98 62.55,29.09 59.5,26.04 58.42,26.04 v56.2,23.82 | v58.19,11.74 58.06,11.61 58.06,5.1
  Bottom 0.203: v56.2,23.82 61.21,18.8 61.21,14.76 v58.19,11.74
GPIO26
  Top 0.152: 84.77,51.76 GPIO_HEADER_FEMALE.37
  Top 0.203: R26.1 96.84,36.2 94.23,36.2 D26.C 94.04,36.45 86.61,43.88 86.61,45.41 86.04,45.98 86.04,50.49 84.77,51.76
GPIO26*  (via drill 0.3, 0.35)
  Top 0.152: GPIO*HEADER_MALE.37 42.75,4.12 42.75,2.55 43.79,1.5 v45.21,1.5
  Route15 0.152: v45.21,1.5 45.72,1 v96.39,1
  Bottom 0.203: R26.2 97.16,26.04 98.74,24.45 98.74,1.72 98.04,1.02 96.38,1.02 v96.39,1
GPIO27
  Top 0.203: GPIO_HEADER_FEMALE.13 52.96,50.68 50.67,50.68 47.62,47.63 47.62,29.72 | 47.62,29.72 R27.1 | 47.62,29.72 D27.C
GPIO27*  (via drill 0.2)
  Top 0.152: 62.86,5.35 63.77,4.44 70.86,4.44 GPIO*HEADER_MALE.13
  Top 0.203: 62.86,5.35 62.86,9.02 62.36,9.53 v60.33,9.53 | v58.42,17.47 58.42,13.28 58.74,12.96 v58.74,9.53
  Bottom 0.203: v58.42,17.47 50.8,17.47 48.89,19.37 R27.2 | v60.33,9.53 v58.74,9.53
N$5
  Bottom 0.203: 5V.A 17.72,5.59 24.51,12.39 RLED1.1
N$6
  Top 0.508: D3V3.A R3V3.1
N$7
  Top 0.203: 15.62,53.92 R5V.2
  Top 0.508: D5V.A 15.62,53.92
N$8
  Bottom 0.203: RLED2.1 25.34,16.52 25.72,16.13 25.72,5.72 3V3.A

### Text on the board
tPlace: GND | 3.3V | 5V | GPIO Protection HaT v4.0 / ECSE2920: Design Methodology
tNames: 40 | 2 | 1 | 39 | WIINW | 39 | 1 | 2 | 40